# EAGLE board Varella_Std - v.2.0 (EAGLE 9.4.2)
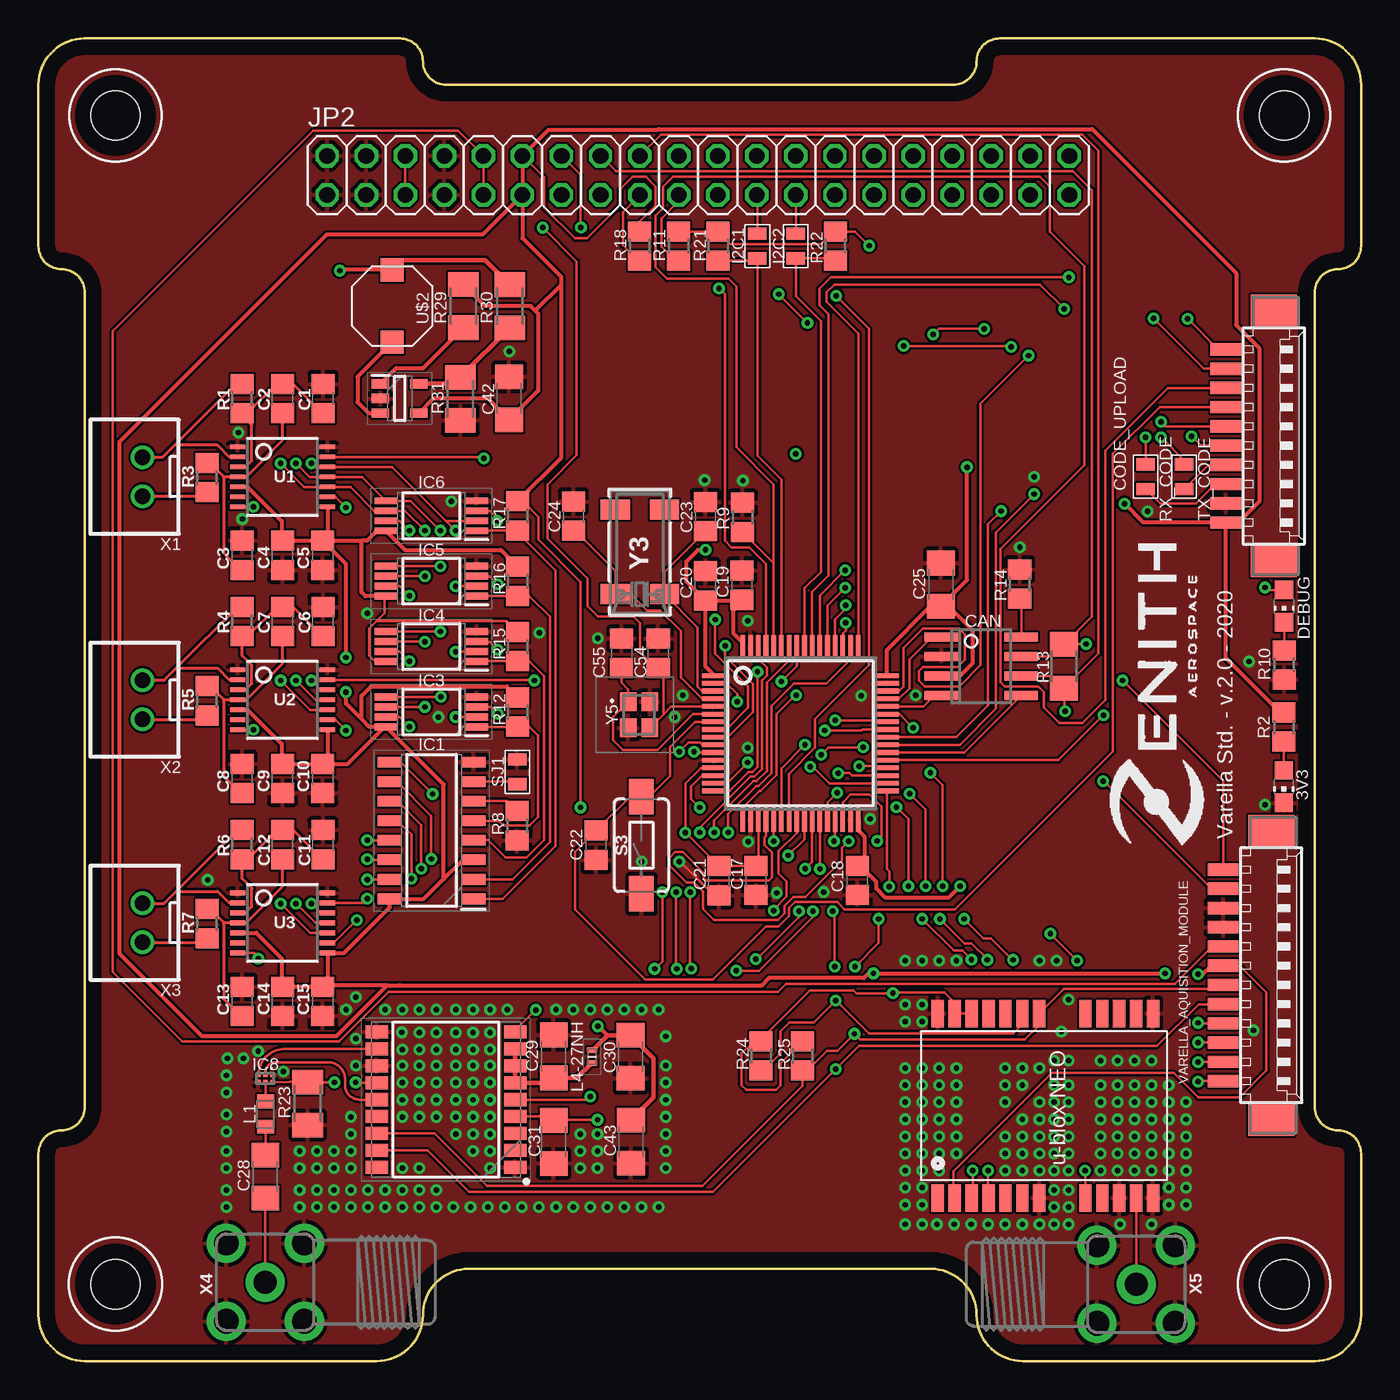
[diagram p2: board, top side]
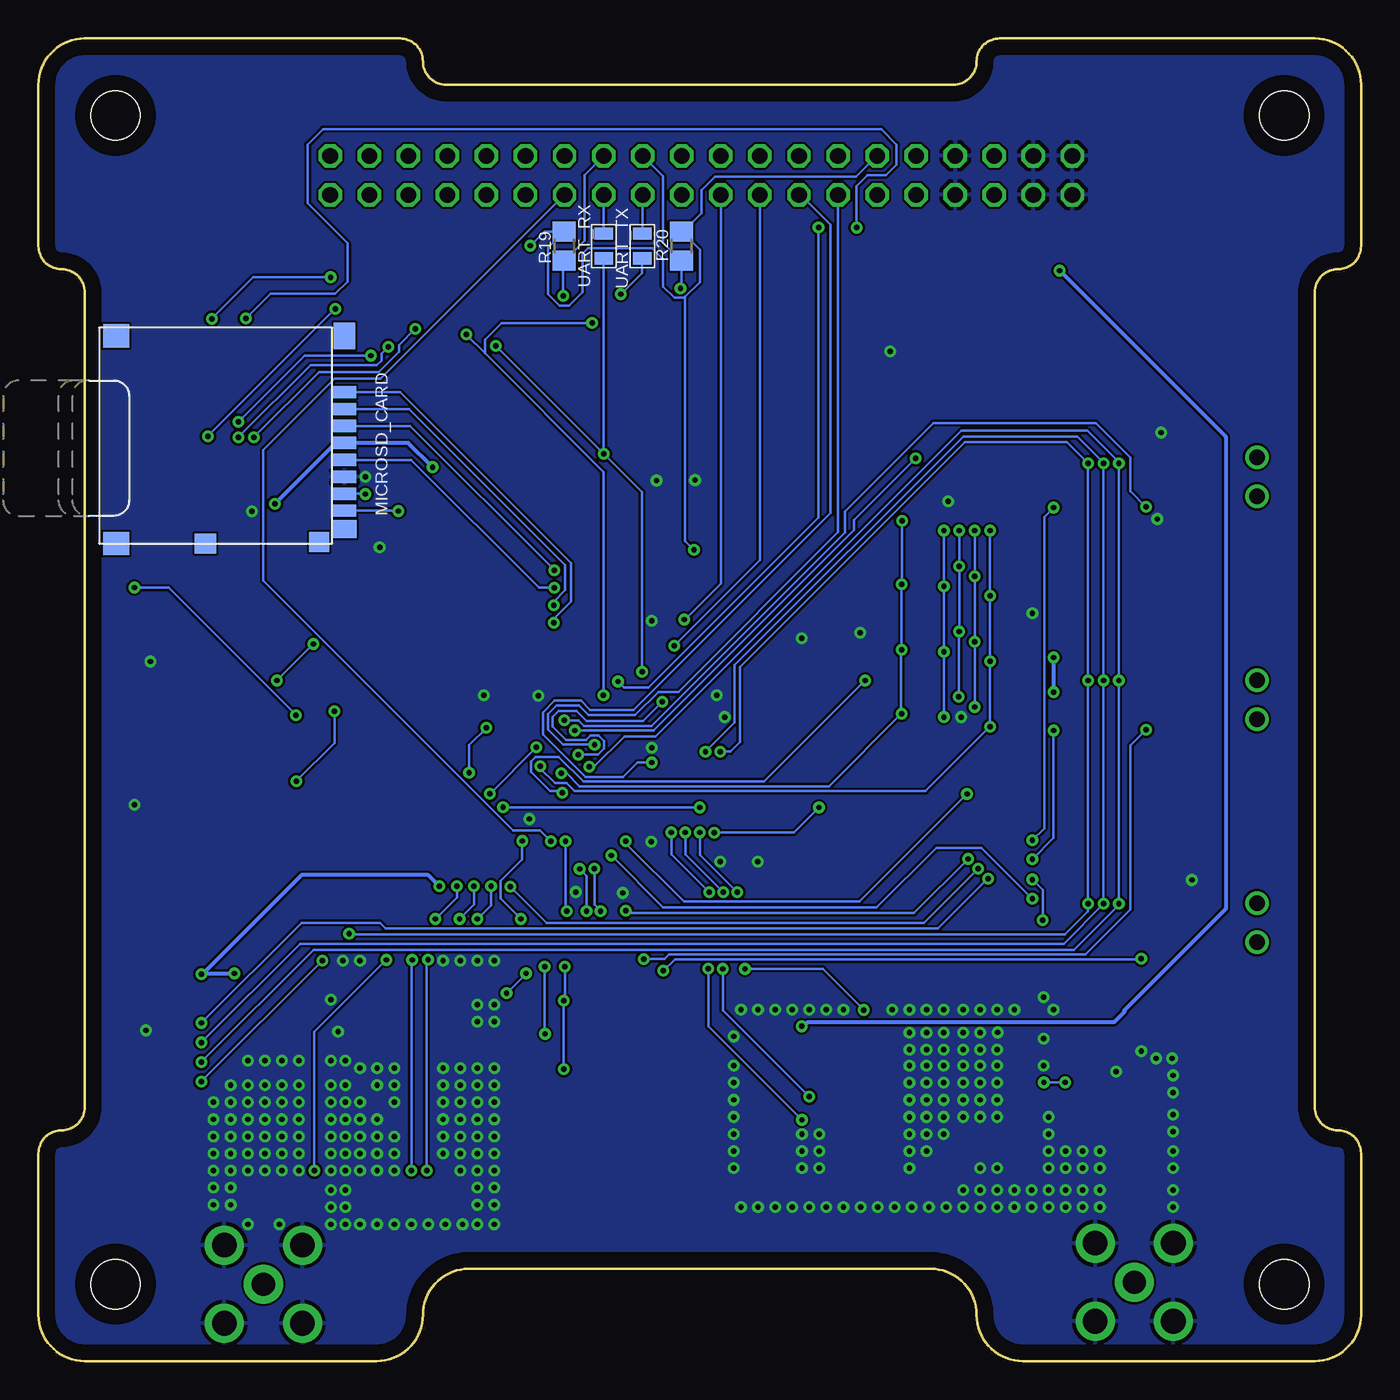
[diagram p3: board, bottom side, seen from below]

Size 86 x 86 mm. Coordinates in mm from the lower left corner, seen from the top.
Outline: 0,83 0,72.5 arc90 1.5,71 arc-90 3,69.5 3,16.5 arc-90 1.5,15 arc90 0,13.5 0,3 arc90 3,0 22,0 arc90 25,3 arc-90 28,6 58,6 arc-90 61,3 arc90 64,0 83,0 arc90 86,3 86,13.5 arc90 84.5,15 arc-90 83,16.5 83,69.5 arc-90 84.5,71 arc90 86,72.5 86,83 arc90 83,86 62.5,86 arc90 61,84.5 arc-90 59.5,83 26.5,83 arc-90 25,84.5 arc90 23.5,86 3,86 arc90 0,83
Copper layers (1*16): Top 0.035mm / dielectric 1.5mm / Bottom 0.035mm
Design rules "default": minimum track width 6mil, minimum drill 0.35mm, track to track 6mil, track to pad 6mil, pad to pad 6mil, via to via 6mil, smd to smd 6mil, copper to edge 40mil, drill to drill 6mil, minimum pad ring 10mil, minimum via ring 8mil, stop-mask expansion 4mil, vias tented up to drill 0mil, thermal gap 10mil
Holes 3.2 mm at 5,5 81,5 81,81 5,81

## Footprints (pad centres in the part's own frame; a part is rotated, then mirrored left to right if it is on the bottom)
CHIP-LED0805 = smd 1.2 x 1.2: A 0,-1.05; C 0,1.05
C0805 = smd 1.3 x 1.5: 1 -0.95,0; 2 0.95,0
C1206 = smd 1.6 x 1.8: 1 -1.4,0; 2 1.4,0
SOIC8 = smd 0.6 x 2.2: 1 -1.905,-2.6; 2 -0.635,-2.6; 3 0.635,-2.6; 4 1.905,-2.6; 5 1.905,2.6; 6 0.635,2.6; 7 -0.635,2.6; 8 -1.905,2.6
53261-10 = smd 0.8 x 2: 1 5.625,-2.5; 2 4.375,-2.5; 3 3.125,-2.5; 4 1.875,-2.5; 5 0.625,-2.5; 6 -0.625,-2.5; 7 -1.875,-2.5; 8 -3.125,-2.5; 9 -4.375,-2.5; 10 -5.625,-2.5 | smd 2.1 x 3: S1 8.125,0.625; S2 -8.125,0.625
LQFP64_10X10 = smd 0.3 x 1.6: 1 -3.75,-5.6; 2 -3.25,-5.6; 3 -2.75,-5.6; 4 -2.25,-5.6; 5 -1.75,-5.6; 6 -1.25,-5.6; 7 -0.75,-5.6; 8 -0.25,-5.6; 9 0.25,-5.6; 10 0.75,-5.6; 11 1.25,-5.6; 12 1.75,-5.6; 13 2.25,-5.6; 14 2.75,-5.6; 15 3.25,-5.6; 16 3.75,-5.6; 33 3.75,5.6; 34 3.25,5.6; 35 2.75,5.6; 36 2.25,5.6; 37 1.75,5.6; 38 1.25,5.6; 39 0.75,5.6; 40 0.25,5.6; 41 -0.25,5.6; 42 -0.75,5.6; 43 -1.25,5.6; 44 -1.75,5.6; 45 -2.25,5.6; 46 -2.75,5.6; 47 -3.25,5.6; 48 -3.75,5.6 | smd 1.6 x 0.3: 17 5.6,-3.75; 18 5.6,-3.25; 19 5.6,-2.75; 20 5.6,-2.25; 21 5.6,-1.75; 22 5.6,-1.25; 23 5.6,-0.75; 24 5.6,-0.25; 25 5.6,0.25; 26 5.6,0.75; 27 5.6,1.25; 28 5.6,1.75; 29 5.6,2.25; 30 5.6,2.75; 31 5.6,3.25; 32 5.6,3.75; 49 -5.6,3.75; 50 -5.6,3.25; 51 -5.6,2.75; 52 -5.6,2.25; 53 -5.6,1.75; 54 -5.6,1.25; 55 -5.6,0.75; 56 -5.6,0.25; 57 -5.6,-0.25; 58 -5.6,-0.75; 59 -5.6,-1.25; 60 -5.6,-1.75; 61 -5.6,-2.25; 62 -5.6,-2.75; 63 -5.6,-3.25; 64 -5.6,-3.75
SMD-JUMPER-2 = smd 0.8 x 1.2: 1 -0.8,0; 2 0.8,0
SOIC127P600X175-16N = smd 1.55 x 0.7: 1 -2.725,4.445; 2 -2.725,3.175; 3 -2.725,1.905; 4 -2.725,0.635; 5 -2.725,-0.635; 6 -2.725,-1.905; 7 -2.725,-3.175; 8 -2.725,-4.445; 9 2.725,-4.445; 10 2.725,-3.175; 11 2.725,-1.905; 12 2.725,-0.635; 13 2.725,0.635; 14 2.725,1.905; 15 2.725,3.175; 16 2.725,4.445
SOP65P640X120-8N = smd 1.475 x 0.45: 1 -2.938,0.975; 2 -2.938,0.325; 3 -2.938,-0.325; 4 -2.938,-0.975; 5 2.938,-0.975; 6 2.938,-0.325; 7 2.938,0.325; 8 2.938,0.975
SON110P970X1010X230-18N = smd 1.45 x 0.85: 1 -4.5,4.4; 2 -4.5,3.3; 3 -4.5,2.2; 4 -4.5,1.1; 5 -4.5,0; 6 -4.5,-1.1; 7 -4.5,-2.2; 8 -4.5,-3.3; 9 -4.5,-4.4; 10 4.5,-4.4; 11 4.5,-3.3; 12 4.5,-2.2; 13 4.5,-1.1; 14 4.5,0; 15 4.5,1.1; 16 4.5,2.2; 17 4.5,3.3; 18 4.5,4.4
BGA725L6E6327 = smd 0.3 x 0.3: 1 0.45,0.25; 2 0,0.25; 3 -0.45,0.25; 4 -0.45,-0.25; 5 0,-0.25; 6 0.45,-0.25
SOT95P280X110-5N = smd 1.15 x 0.6: 1 -1.25,0.95; 2 -1.25,0; 3 -1.25,-0.95; 4 1.25,-0.95; 5 1.25,0.95
2X20 = drill 1.016 octagon: 1 -24.13,-1.27; 2 -24.13,1.27; 3 -21.59,-1.27; 4 -21.59,1.27; 5 -19.05,-1.27; 6 -19.05,1.27; 7 -16.51,-1.27; 8 -16.51,1.27; 9 -13.97,-1.27; 10 -13.97,1.27; 11 -11.43,-1.27; 12 -11.43,1.27; 13 -8.89,-1.27; 14 -8.89,1.27; 15 -6.35,-1.27; 16 -6.35,1.27; 17 -3.81,-1.27; 18 -3.81,1.27; 19 -1.27,-1.27; 20 -1.27,1.27; 21 1.27,-1.27; 22 1.27,1.27; 23 3.81,-1.27; 24 3.81,1.27; 25 6.35,-1.27; 26 6.35,1.27; 27 8.89,-1.27; 28 8.89,1.27; 29 11.43,-1.27; 30 11.43,1.27; 31 13.97,-1.27; 32 13.97,1.27; 33 16.51,-1.27; 34 16.51,1.27; 35 19.05,-1.27; 36 19.05,1.27; 37 21.59,-1.27; 38 21.59,1.27; 39 24.13,-1.27; 40 24.13,1.27
INDC1608X100N = smd 0.89 x 1.11: 1 -0.814,0; 2 0.814,0
LQG15WH0N7B02D = smd 0.35 x 0.65: 1 -0.425,0; 2 0.425,0
MOLEX-502774-0891-MICROSD = smd 0.8 x 1.5: 1 -3.3,8.2; 2 -2.2,8.2; 3 -1.1,8.2; 4 0,8.2; 5 1.1,8.2; 6 2.2,8.2; 7 3.3,8.2; 8 4.4,8.2 | smd 1.29 x 1.3: 9 6.455,6.55 | smd 1.29 x 1.4: 10 6.54,-0.85 | smd 1.5 x 1.7: 11 6.54,-6.65; 12 -6.96,-6.65 | smd 1.7 x 1.4: 14 -6.96,8.2 | smd 1.2 x 1.6: 15 5.6,8.2
R0805 = smd 1.3 x 1.5: 1 -0.95,0; 2 0.95,0
R1206 = smd 1.6 x 1.803: 1 -1.422,0; 2 1.422,0
M1206 = smd 1.6 x 2: 1 -1.4,0; 2 1.4,0
TACTILE_SWITCH_SMD_6.0X3.5MM = smd 2.3 x 1.6: 1 -3.15,0; 2 3.15,0
TSSOP14 = smd 0.305 x 0.991: 1 -1.95,-2.918; 2 -1.3,-2.918; 3 -0.65,-2.918; 4 0,-2.918; 5 0.65,-2.918; 6 1.3,-2.918; 7 1.95,-2.918; 8 1.95,2.918; 9 1.3,2.918; 10 0.65,2.918; 11 0,2.918; 12 -0.65,2.918; 13 -1.3,2.918; 14 -1.95,2.918
LTF5022T = smd 1.5 x 1.5: P$1 -2.35,0; P$2 2.35,0
NEO-M8 = smd 1.8 x 0.8: 1 6.4,-7.4; 2 6.4,-6.3; 3 6.4,-5.2; 4 6.4,-4.1; 5 6.4,-3; 6 6.4,-1.9; 7 6.4,-0.8; 8 6.4,2.2; 9 6.4,3.3; 10 6.4,4.4; 11 6.4,5.5; 12 6.4,6.6; 13 -5.6,6.6; 14 -5.6,5.5; 15 -5.6,4.4; 16 -5.6,3.3; 17 -5.6,2.2; 18 -5.6,-0.8; 19 -5.6,-1.9; 20 -5.6,-3; 21 -5.6,-4.1; 22 -5.6,-5.2; 23 -5.6,-6.3; 24 -5.6,-7.4
53261-12 = smd 0.8 x 2: 1 6.875,-2.5; 2 5.625,-2.5; 3 4.375,-2.5; 4 3.125,-2.5; 5 1.875,-2.5; 6 0.625,-2.5; 7 -0.625,-2.5; 8 -1.875,-2.5; 9 -3.125,-2.5; 10 -4.375,-2.5; 11 -5.625,-2.5; 12 -6.875,-2.5 | smd 2.1 x 3: S1 9.375,0.625; S2 -9.375,0.625
JST-XH-02-PACKAGE-ROUND-PAD = drill 1.016: 1 -1.27,0; 2 1.27,0
SMA90_DIP = drill 1.5 pad 2.54: ANTENNA 0,0 | drill 1.6 pad 2.54: GND1 -2.54,2.54; GND2 2.54,2.54; GND3 -2.54,-2.54; GND4 2.54,-2.54
CRYSTAL_8X3.8 = smd 1.3 x 1.9: P$1 -2.75,-1.6; P$2 2.75,-1.6; P$3 2.75,1.6; P$4 -2.75,1.6
FA20H160000MF12ZAC3 = smd 1.2 x 1.1: 1 -0.85,-0.7; 2 0.85,-0.7; 3 0.85,0.7; 4 -0.85,0.7

## Placement (x,y rotation side)
3V3  [CHIP-LED0805]  80.97,37.35 180 top
C1  0.01uF  [C0805]  18.5,62.58 270 top
C2  0.1uF  [C0805]  15.87,62.58 270 top
C3  0.01uF  [C0805]  13.24,52.39 90 top
C4  0.1uF  [C0805]  15.87,52.39 270 top
C5  0.1uF  [C0805]  18.49,52.39 270 top
C6  0.01uF  [C0805]  18.5,48.08 270 top
C7  0.1uF  [C0805]  15.87,48.08 270 top
C8  0.01uF  [C0805]  13.24,37.89 90 top
C9  0.1uF  [C0805]  15.87,37.89 270 top
C10  0.1uF  [C0805]  18.49,37.89 270 top
C11  0.01uF  [C0805]  18.5,33.58 270 top
C12  0.1uF  [C0805]  15.87,33.58 270 top
C13  0.01uF  [C0805]  13.24,23.39 90 top
C14  0.1uF  [C0805]  15.87,23.39 270 top
C15  0.1uF  [C0805]  18.49,23.39 270 top
C17  100nF  [C0805]  46.66,31.25 270 top
C18  100nF  [C0805]  53.24,31.25 270 top
C19  100nF  [C0805]  45.74,50.45 90 top
C20  100nF  [C0805]  43.37,50.41 90 top
C21  1uF  [C0805]  44.24,31.23 270 top
C22  0,1uF  [C0805]  36.26,33.54 90 top
C23  10pF  [C0805]  43.37,54.91 270 top
C24  10pF  [C0805]  34.79,54.94 270 top
C25  1nF  [C1206]  58.67,50.49 90 top
C28  1nF  [C1206]  14.75,12 270 top
C29  56pF  [C1206]  33.5,19.81 90 top
C30  10nF  [C1206]  38.5,19.79 270 top
C31  56pF  [C1206]  33.5,14.25 90 top
C42  56pF  [C1206]  30.61,62.6 90 top
C43  22uF  [C1206]  38.52,14.27 270 top
C54  10pF  [C0805]  40.3,46.02 90 top
C55  10pF  [C0805]  37.92,46.02 90 top
CAN  SN65HVD233D  [SOIC8]  61.3,45.17 270 top
CODE_UPLOAD  53261-10  [53261-10]  79.7,60.15 270 top
COMM_MICRO  STM32L496RGT6  [LQFP64_10X10]  49.55,40.82 270 top
DEBUG  [CHIP-LED0805]  81,49.1 180 top
I2C1  [SMD-JUMPER-2]  46.75,72.5 270 top
I2C2  [SMD-JUMPER-2]  49.25,72.5 270 top
IC1  74HC4051D,653  [SOIC127P600X175-16N]  25.56,34.5 180 top
IC3  M95M04-DRDW6TP  [SOP65P640X120-8N]  25.55,42.21 180 top
IC4  M95M04-DRDW6TP  [SOP65P640X120-8N]  25.55,46.46 180 top
IC5  M95M04-DRDW6TP  [SOP65P640X120-8N]  25.55,50.71 180 top
IC6  M95M04-DRDW6TP  [SOP65P640X120-8N]  25.55,54.96 180 top
IC7  TESEO-LIV3F  [SON110P970X1010X230-18N]  26.5,17 180 top
IC8  BGA_725L6_E6327  [BGA725L6E6327]  14.75,18.38 0 top
IC13  ST1S12GR  [SOT95P280X110-5N]  23.49,62.59 0 top
JP2  [2X20]  42.9,77.1 0 top
L1  LQW18AS7N5J0ZD-7,5nH  [INDC1608X100N]  14.78,16.07 270 top
L4-27NH  LQG15HS27NJ02D  [LQG15WH0N7B02D]  36,19.79 270 top
MICROSD_CARD  MOLEX-502774-0891-MICROSD  [MOLEX-502774-0891-MICROSD]  74.3,59.7 270 bottom
R1  100  [R0805]  13.24,62.58 270 top
R2  220  [R0805]  80.98,41.22 90 top
R3  100  [R0805]  10.96,57.44 90 top
R4  100  [R0805]  13.24,48.08 270 top
R5  100  [R0805]  10.96,42.94 90 top
R6  100  [R0805]  13.24,33.58 270 top
R7  100  [R0805]  10.96,28.44 90 top
R8  1k  [R0805]  31.12,34.81 90 top
R9  1k  [R0805]  45.78,54.87 90 top
R10  220  [R0805]  81,45.26 90 top
R11  4,7k  [R0805]  41.62,72.5 90 top
R12  4,7k  [R0805]  31.16,42.2 90 top
R13  120  [R1206]  66.67,45.17 270 top
R14  100  [R0805]  63.8,50.52 270 top
R15  4,7k  [R0805]  31.16,46.45 90 top
R16  4,7k  [R0805]  31.16,50.7 90 top
R17  4,7k  [R0805]  31.16,54.95 90 top
R18  4,7k  [R0805]  39.09,72.5 90 top
R19  4,7k  [R0805]  51.81,72.5 90 bottom
R20  4,7k  [R0805]  44.19,72.5 90 bottom
R21  4,7k  [R0805]  44.19,72.5 270 top
R22  4,7k  [R0805]  51.81,72.5 270 top
R23  10k  [M1206]  17.5,16.75 90 top
R24  4,7k  [R0805]  46.99,19.84 90 top
R25  4,7k  [R0805]  49.69,19.84 90 top
R29  1M  [M1206]  27.63,68.6 90 top
R30  68k  [M1206]  30.65,68.59 90 top
R31  27k  [M1206]  27.43,62.57 90 top
RX_CODE  [SMD-JUMPER-2]  72,57.5 270 top
S3  MOMENTARY-SWITCH-SPST-SMD-6.0X3.5MM  [TACTILE_SWITCH_SMD_6.0X3.5MM]  39.2,33.53 90 top
SJ1  [SMD-JUMPER-2]  31.12,38.31 90 top
TX_CODE  [SMD-JUMPER-2]  74.5,57.5 270 top
U1  MAX31856  [TSSOP14]  15.87,57.49 270 top
U2  MAX31856  [TSSOP14]  15.87,42.99 270 top
U3  MAX31856  [TSSOP14]  15.87,28.49 270 top
U$2  LTF5022T100M1R4  [LTF5022T]  23,68.6 270 top
U$3  NEO-M8  [NEO-M8]  65.88,17 270 top
UART_RX  [SMD-JUMPER-2]  49.25,72.5 270 bottom
UART_TX  [SMD-JUMPER-2]  46.75,72.5 270 bottom
VARELLA_AQUISITION_MODULE  53261-12  [53261-12]  79.53,25.08 270 top
X1  JST-XH-02-PIN-ROUND-PAD  [JST-XH-02-PACKAGE-ROUND-PAD]  6.77,57.5 90 top
X2  JST-XH-02-PIN-ROUND-PAD  [JST-XH-02-PACKAGE-ROUND-PAD]  6.77,43 90 top
X3  JST-XH-02-PIN-ROUND-PAD  [JST-XH-02-PACKAGE-ROUND-PAD]  6.77,28.5 90 top
X4  [SMA90_DIP]  14.75,5.12 270 top
X5  [SMA90_DIP]  71.38,5 90 top
Y3  [CRYSTAL_8X3.8]  39.11,52.61 90 top
Y5  FA-20H_16.0000MF10Z-AJ0  [FA20H160000MF12ZAC3]  39.05,42.02 270 top

## Tracks (layer width: path | path; a pad name or v marks a point on that pad's centre or on a via)
!DRDY_1  (via drill 0.35)
  Top 0.152: U1.7 v13.98,55.54 | v51.81,41.66 54.25,41.66 54.34,41.57 COMM_MICRO.42
  Bottom 0.152: v13.98,55.54 15,56.56 15,58.75 17.25,61 27.81,61 33.56,55.25 33.56,53.88 46.13,41.3 50.52,41.3 50.88,41.66 v51.81,41.66
!DRDY_2  (via drill 0.35)
  Top 0.152: U2.7 v13.98,41.04 | v49.45,29.25 49.45,28.88 46.72,26.14 v46.64,26.14 | v49.86,32.02 50.3,32.47 COMM_MICRO.26
  Bottom 0.152: v13.98,41.04 15,40.02 15,29.38 17.94,26.44 45,26.44 45.29,26.14 v46.64,26.14 | v49.86,32.02 49.86,29.7 49.45,29.3 v49.45,29.25
!DRDY_3  (via drill 0.35)
  Top 0.152: U3.7 14.02,26.54 v14.29,26.16 | v50.36,29.25 50.36,28.89 46.84,25.38 v45.38,25.38 | COMM_MICRO.27 v50.8,32.01 v50.81,32
  Bottom 0.152: v14.29,26.16 14.33,26.12 44.62,26.12 v45.38,25.38 | v50.81,32 50.36,31.55 v50.36,29.25
!FAULT_1  (via drill 0.35)
  Top 0.152: U1.13 28.87,58.79 v28.97,58.69 | v51.12,41 53.5,41 53.57,41.07 COMM_MICRO.41
  Bottom 0.152: v28.97,58.69 32.97,54.69 32.97,54.03 46,41 v51.12,41
!FAULT_2  (via drill 0.35)
  Top 0.152: U2.13 32.21,44.29 v32.25,44.25 | v51.93,36.95 51.3,36.32 COMM_MICRO.28
  Bottom 0.152: v32.25,44.25 38.81,37.69 50.56,37.69 52.17,39.29 53.69,39.29 53.98,39 53.98,38.31 52.73,37.05 52.04,37.05 v51.93,36.95
!FAULT_3  (via drill 0.35)
  Top 0.152: 19.16,29.79 U3.13 21.1,29.79 v21.38,30.06 | COMM_MICRO.25 49.8,33.93 v48.75,32.88
  Bottom 0.152: v21.38,30.06 24.69,33.38 27.62,33.38 31.5,29.5 45.38,29.5 v48.75,32.88
!HOLD  (via drill 0.35)
  Top 0.152: IC6.7 23.49,54.63 v24.12,54 | IC5.7 23.49,50.38 v24.12,49.75 | IC4.7 23.49,46.13 v24.12,45.5 | IC3.7 23.49,41.88 v24.12,41.25 | v53.38,38.69 54.19,38.69 54.3,38.57 COMM_MICRO.36
  Bottom 0.152: v24.12,54 v24.12,49.75 v24.12,45.5 v24.12,41.25 28.31,37.06 51.13,37.06 51.66,37.59 52.42,37.59 53.38,38.55 v53.38,38.69
!W  (via drill 0.35)
  Top 0.152: v29.84,54.62 29.84,54.81 29.37,55.28 IC6.3 | IC5.3 28.52,51 29.38,51 v29.88,50.5 | IC4.3 28.52,46.75 29.38,46.75 v29.88,46.25 | IC3.3 29.43,42.53 v29.88,42.09 | v52,38.23 52.72,38.23 52.88,38.07 COMM_MICRO.35
  Bottom 0.152: v29.84,54.62 29.84,50.53 v29.88,50.5 v29.88,46.25 29.91,46.22 29.91,42.12 v29.88,42.09 34.59,37.38 50.81,37.38 51.67,38.23 v52,38.23
+3V3  (via drill 0.35)
  Top 0.152: 15.82,38.84 C9.1 | 15.82,24.34 C14.1 | 15.82,53.34 C4.1 | 58.67,49.8 58.67,49.62 | 58.67,49.62 C25.1 | 59.91,44.54 59.94,44.56 | 59.38,48.88 59.17,49.09 58.88,49.09 | COMM_MICRO.19 46.8,32.35 C17.1 46.64,32.19 C21.1 v42.06,34.36 42.06,37.56 43.07,38.57 COMM_MICRO.13 | 53.3,32.26 C18.1 | C18.1 | 58.25,49.55 58.6,49.55 58.67,49.62 | 45.8,49.44 C19.1 45.7,49.45 45.56,49.45 | 43.37,49.38 C20.1 | IC3.8 22.5,41.23 | IC4.8 21.89,45.48 21.5,45.88 21.5,47.62 22,48.12 | 22,48.12 30.44,48.12 R15.2 | IC5.8 22.5,49.73 | 22.5,49.73 21.89,49.73 | 30.44,52.38 31.03,51.78 R16.2 | IC6.8 22,53.98 21.89,53.98 | 22.5,49.73 22.5,48.62 22,48.12 | IC1.16 23.8,30.05 | IC1.3 28.25,32.59 | R11.2 R21.1 45.01,72.62 50.89,72.62 51.71,73.45 R22.1 53.09,73.45 v54.01,72.52 | JP2.11 31.45,75.81 | 5.26,26.5 5.26,26.49 | R18.2 39.09,74.09 40.12,75.12 40.12,76.38 39.5,77 38.62,77 37.86,76.24 37.86,75.19 35.67,73 34.88,73 32.88,75 32.88,76.97 JP2.12 | 23.5,24.44 22.31,24.44 22.31,24.43 | U$3.23 U$3.22 60.67,23.3 | 22.68,24.43 22.31,24.43 | 18.75,24.43 22.31,24.43 | 31.45,56.11 31.27,55.93 31.19,55.93 R17.2 31.5,55.91 32.51,54.89 32.51,53.41 35.25,50.66 v35.25,36 | 53.37,32.07 C18.1 | 59.23,30.18 59.17,30.12 | 19.79,52.04 19.73,52.1 | U$3.23 59.58,23.43 | 77.38,54.52 CODE_UPLOAD.1 | U$3.2 59.5,10.68 59.5,12.35 65.88,18.73 73.82,18.73 75.41,17.14 78.11,17.14 79.85,18.89 79.85,23.97 78.11,25.71 VARELLA_AQUISITION_MODULE.7 | U$3.23 59.58,23.29 58.9,23.97 55.62,23.97 v55.56,23.91 53.19,23.91 53,24.1 50.16,24.1 46.99,20.93 R24.2 46.51,20.79 45.72,20 45.72,17.94 46.04,17.62 47.94,17.62 48.26,17.94 48.26,19.36 R25.2
  Top 0.203: 18.7,39.05 C10.1 | 18.79,24.64 18.58,24.43
  Top 0.254: JP2.11 28.89,73.25 18.75,73.25 5.26,59.76 5.26,26.5 | 22.68,24.43 19.4,21.15 10.6,21.15 5.26,26.49 | 22.68,24.43 18.75,24.43 18.58,24.43 C15.1 C14.1 | 18.79,24.64 U3.8 19.88,26.54 22.84,29.5 IC1.16 25.05,30.05 26.34,31.34 | U3.5 14.16,27.84 15.82,26.18 15.82,24.34 | 28.25,32.59 27.59,32.59 26.34,31.34 | 26.34,31.34 26.34,37.5 IC3.8 21.52,41.23 21,41.75 | 22.5,41.23 20.11,38.84 C10.1 C9.1 | 18.7,39.05 18.79,39.14 U2.8 | U2.5 13.61,42.34 15.82,40.13 15.82,38.84 | v20,43.5 20,42.75 21,41.75 | 21,41.75 21,43.25 21.62,43.88 30.44,43.88 R12.2 | v20,45.75 20,51.83 19.79,52.04 | 19.73,52.1 C5.1 | C4.1 C5.1 | C5.1 21,53.34 | 21,53.34 21.36,53.34 22,53.98 | IC5.8 21.27,49.73 21,50 21,53.34 | IC6.8 23.84,52.75 30.07,52.75 31.03,51.78 | U1.8 18.79,53.64 C5.1 | U1.5 13.61,56.84 15.82,54.63 15.82,53.34 | JP2.11 JP2.12 33.16,80.06 40.27,80.06 40.32,80.11 68.52,80.11 77.88,70.75 77.88,67.38 79.38,65.88 79.38,55.88 78.03,54.52 77.38,54.52 | v70.62,55.75 71.85,54.52 CODE_UPLOAD.1 77.2,45.72 80.74,42.17 R2.2 | 58.88,49.09 C25.1 | C25.1 60.38,50.79 v60.38,58.12 | CAN.3 59.91,44.54 | 59.94,44.56 60.74,45.36 60.74,47.52 59.38,48.88 | COMM_MICRO.48 55.16,46.23 58.01,49.09 C25.1 | COMM_MICRO.64 45.8,46.7 45.19,47.31 45.19,48.82 45.8,49.44 | 45.56,49.45 C20.1 42.12,50.7 42.12,52 42.88,52.75 v43.38,52.75 | 43.37,49.38 43.34,49.35 43.34,45.18 COMM_MICRO.1 | 22.68,24.43 22.69,24.44 23.5,24.44 47.04,24.44 47.5,24.9 53.66,24.9 53.98,25.21 v54.29,25.21 v73.26,25.21 | v59.92,30.88 59.23,30.18 | 59.17,30.12 55.08,30.12 54.48,30.73 54.48,31.16 53.57,32.07 53.37,32.07 | COMM_MICRO.32 53.34,35.19 53.34,34.48 53.7,34.11 53.7,32.66 53.3,32.26
  Top 0.254: R17.2 34,58.74 34,70 | 34,70 34,70.47 31.47,73 JP2.11 | 34,70 32.3,68.3 | R29.2 29.03,68.6 32,68.6 32.3,68.3 | 32.3,68.3 32.5,68.1 32.5,63.09 C42.1 29.2,62.6 25.7,62.6 IC13.4 | v75.41,25.16 75.72,25.16 76.27,25.71 VARELLA_AQUISITION_MODULE.7
  Bottom 0.152: 66.2,59.6 MICROSD_CARD.4 66.67,59.7 | 43.95,69.2 44,69.14 44.64,69.14 45.38,69.88 45.38,71.65 46.1,72.38 50.25,72.38 50.62,72 50.62,69.5 51.5,68.62 52.12,68.62 52.88,69.38 52.88,72.39 R22.1 53.09,73.45 v54.01,72.52 | 43.95,69.2 43,70.14 43,72.26 44.12,73.38 | 44.12,73.38 R21.1 | JP2.12 32.84,77 42,77 42.88,76.12 42.88,74.62 44.12,73.38 | v42.06,34.36 36.89,34.36 v35.25,36 | v43.38,52.75 43.95,53.32 43.95,69.2 | v55.56,23.91 54.29,25.18 v54.29,25.21
  Bottom 0.254: v20,45.75 v20,43.5 | v70.62,55.75 66.67,59.7 | v60.38,58.12 61.95,59.7 MICROSD_CARD.4 | v59.92,30.88 60.65,31.6 68.9,31.6 75.34,25.16 v75.41,25.16 75.36,25.21 v73.26,25.21
+5V
  Top 0.152: JP2.9 JP2.10 27.3,80 17.88,80 4.83,66.96 4.83,25.29 9.35,20.77 19.56,20.77 22.78,24 48.1,24 48.62,24.52 73.89,24.52 76.36,26.99 77,26.99 VARELLA_AQUISITION_MODULE.8
BAT+
  Top 0.152: JP2.5 JP2.6
BOOT
  Top 0.152: R9.1 47.8,51.9 | 47.8,51.9 COMM_MICRO.60 | 47.8,51.9 47.8,57 45.38,59.43 45.38,69.88 44.88,70.38 40.88,70.38 40.12,71.13 40.12,74.47 40.62,74.97 40.62,76.38 41.25,77 65.12,77 65.75,76.38 65.75,73.45 68,71.2 68,58.25 62.55,52.8 62.55,44.16 62.84,43.88 65,43.88 65.08,43.8 65.09,43.8 65.38,43.52 65.38,42.5 66.38,41.5 67.88,41.5 69.38,43 69.38,59.2 73.45,63.27 CODE_UPLOAD.8 77.9,63.27
CAN1_LBK
  Top 0.152: COMM_MICRO.38 60.2,39.57 CAN.5
CAN1_RX
  Top 0.152: 55.95,42.57 COMM_MICRO.44 | 55.95,42.57 COMM_MICRO.44 | CAN.4 58.25,43.27 57.55,42.57 COMM_MICRO.44
CAN1_TX
  Top 0.152: CAN.1 58.09,47.08 56.63,45.62 56.63,43.74 55.95,43.07 COMM_MICRO.45
CAN_H  (via drill 0.35)
  Top 0.152: R13.1 65.89,45.81 CAN.7 | JP2.16 37.55,77.38 67.25,77.38 68.5,76.12 68.5,48.42 R13.1 | v68.12,46.62 66.7,46.62 R13.1 | VARELLA_AQUISITION_MODULE.12 77.03,37.72 v70.5,44.25
  Bottom 0.152: v70.5,44.25 v68.12,46.62
CAN_L  (via drill 0.35)
  Top 0.152: CAN.6 65.89,44.54 R13.2 66.71,43.79 | JP2.18 40.47,79.75 67.88,79.75 68.93,78.69 68.93,46.01 66.71,43.79 | v66.75,42.25 66.71,42.29 66.71,43.79 | VARELLA_AQUISITION_MODULE.11 76.29,30.71 69.29,37.71 v69.23,37.71
  Bottom 0.152: v69.23,37.71 66.75,40.19 v66.75,42.25
EXT_INTERRUPT_NEOM8  (via drill 0.35)
  Top 0.152: 44.75,44.06 43.96,44.06 COMM_MICRO.2 44.74,44.07 45.44,43.38 v45.44,42.88 | v50.89,39.42 51.38,39.9 v53.63,39.9 | v56.66,36.89 57.68,35.87 v57.68,30.88 | v61.7,26.08 61.7,26.14 60.68,27.16 60.2,27.16 v58.62,28.75 | v61.75,12.38 61.75,10.62 U$3.4
  Bottom 0.152: v50.89,39.42 50.88,39.44 49.62,39.44 49.23,39.83 49.23,40.33 49.59,40.69 50.09,40.69 50.39,40.39 51.7,40.39 52.56,41.25 52.56,41.88 52.17,42.27 51.01,42.27 50.35,41.61 46.7,41.61 v45.44,42.88 | v53.63,39.9 56.65,36.89 v56.66,36.89 | v57.68,30.88 57.68,29.69 v58.62,28.75 | 61.72,12.41 v61.75,12.38 61.75,26.08 v61.7,26.08
EXT_INTERRUPT_TESEO  (via drill 0.35)
  Top 0.152: v41.5,25.5 41.47,25.53 v41.47,30.48 | COMM_MICRO.58 48.8,45.55 47.36,44.11 47.36,38.37 46.7,37.7 46.49,37.7 43.94,35.15 v43.94,34.38 | IC7.5 35.69,17 v35.88,17.19
  Bottom 0.152: v43.94,34.38 43.94,32.95 v41.47,30.48 | v41.5,25.5 41.5,22.81 v35.88,17.19
GND  (via drill 0.35)
  Top 0.152: C21.2 43.93,30.29 41.75,32.47 v41.66,32.47
  other vias: 46.12,39.88 21.38,48.62 48,30.44 51.06,30.5 15.94,18.81 11,31.28 26.84,55.91 46.16,33.78 32.56,47.34 26,41.88 63.81,52.91 54.09,35.25 53.49,43.26 57.03,43.28 43.31,57.28 45.81,57.25 79,21.5 78.71,45.49 79.75,36.17 46.12,48.12 64.75,57.5 72.12,55.25 13.25,54.75 13,60.38 39.22,32.47 41.38,41.88 36.38,47 30.62,65.66 23.62,21.38 12.29,19.68 41.9,43.3 20.64,20.95 20.64,19.21 24.77,21.35 25.88,21.35 23.65,20.24 24.77,20.24 25.88,20.24 27.15,21.35 28.26,21.35 29.37,21.35 27.15,20.24 28.26,20.24 29.37,20.24 23.65,19.21 24.77,19.21 25.88,19.21 27.15,19.21 28.26,19.21 29.37,19.21 23.65,18.1 24.77,18.1 25.88,18.1 27.15,18.1 28.26,18.1 29.37,18.1 23.65,16.99 23.65,15.88 24.77,16.99 24.77,15.88 25.88,15.88 25.88,16.99 27.15,16.99 28.26,16.99 29.37,16.99 27.15,15.88 28.26,15.88 29.37,15.88 27.15,14.76 28.26,14.76 29.37,14.76 28.26,13.65 29.37,13.65 29.37,12.54 23.65,12.54 24.77,12.54 40.32,10 39.21,10 38.1,10 36.99,10 35.88,10 34.77,10 33.66,10 32.54,10 31.43,10 30.32,10 29.21,10 28.1,10 26.99,10 25.88,10 25.88,11.11 24.77,10 24.77,11.11 23.65,10 23.65,11.11 22.54,10 22.54,11.11 21.43,10 21.43,11.11 20.32,10 20.32,11.11 19.21,10 19.21,11.11 18.1,10 18.1,11.11 16.99,10 16.99,11.11 16.99,12.54 16.99,13.65 18.1,12.54 18.1,13.65 19.21,12.54 19.21,13.65 20.32,12.54 20.32,13.65 20.32,14.76 20.32,15.88 13.34,19.68 14.29,20.16 12.22,17.46 12.22,18.57 12.22,10 12.22,11.11 12.22,12.54 12.22,13.65 12.22,14.92 12.22,16.03 35.24,14.76 35.24,13.65 35.24,12.54 36.35,14.76 36.35,13.65 36.35,12.54 40.8,14.76 40.8,13.65 40.8,12.54 40.8,18.1 40.8,16.99 40.8,15.88 22.54,22.86 27.15,22.86 28.26,22.86 29.37,22.86 30.48,22.86 40.32,22.86 39.21,22.86 38.1,22.86 23.65,22.86 24.77,22.86 25.88,22.86 33.66,22.86 34.77,22.86 35.88,22.86 36.99,22.86 40.8,19.21 40.8,21.11 20,22.86 20.64,23.65 72.39,14.61 56.36,23.18 57.47,23.18 56.36,22.07 57.47,22.07 56.36,19.05 57.47,19.05 58.58,19.05 59.69,19.05 56.36,17.94 57.47,17.94 56.36,16.83 57.47,16.83 58.58,17.94 59.69,17.94 58.58,16.83 59.69,16.83 56.36,15.72 57.47,15.72 56.36,14.61 57.47,14.61 58.58,15.72 59.69,15.72 58.58,14.61 59.69,14.61 56.36,13.49 57.47,13.49 56.36,12.38 57.47,12.38 56.36,11.27 57.47,11.27 56.36,10.16 57.47,10.16 65.09,8.89 73.5,15.72 74.61,15.72 73.5,14.61 74.61,14.61 73.5,17.94 73.5,16.83 74.61,16.83 73.5,13.49 74.61,13.49 73.5,12.38 74.61,12.38 73.5,11.27 74.61,11.27 73.5,10.16 74.61,10.16 58.58,13.49 59.69,13.49 58.58,12.38 56.36,8.89 57.47,8.89 58.42,8.89 59.53,8.89 60.64,8.89 61.75,8.89 62.87,8.89 63.98,8.89 66.04,8.89 66.99,8.89 66.99,10 66.04,10 66.04,11.11 66.99,11.11 66.99,12.38 66.04,12.38 65.09,12.38 63.98,12.38 62.87,12.38 62.87,13.49 63.98,13.49 65.09,13.49 66.04,13.49 66.99,13.49 66.99,14.61 66.04,14.61 65.09,14.61 63.98,14.61 65.09,15.72 66.04,15.72 66.99,15.72 66.99,16.83 66.04,16.83 66.99,17.94 62.87,16.83 62.87,17.94 63.98,17.94 62.87,19.05 63.98,19.05 65.09,19.05 66.52,21.43 66.99,23.5 70.33,8.89 72.39,8.89 69.06,12.38 70.17,12.38 71.28,12.38 72.39,12.38 72.39,13.49 71.28,13.49 70.17,13.49 69.06,13.49 69.06,14.61 70.17,14.61 71.28,14.61 69.06,15.72 69.06,16.83 69.06,17.94 70.17,17.94 71.28,17.94 72.39,17.94 70.17,16.83 70.17,15.72 71.28,16.83 71.28,15.72 72.39,16.83 72.39,15.72 56.36,26.04 57.47,26.04 58.58,26.04 59.69,26.04 62.87,14.61 63.98,15.72 65.09,16.83 66.04,17.94 66.04,19.53 66.99,19.53 69.06,19.53 70.17,19.53 71.28,19.53 72.39,19.53 65.09,26.04 66.2,26.04
  pour Top: 64,0 83,0 arc90 86,3 86,13.5 arc90 84.5,15 arc-90 83,16.5 83,69.5 arc-90 84.5,71 arc90 86,72.5 86,83 arc90 83,86 62.5,86 arc90 61,84.5 arc-90 59.5,83 26.5,83 arc-90 25,84.5 arc90 23.5,86 3,86 arc90 0,83 0,72.5 arc90 1.5,71 arc-90 3,69.5 3,16.5 arc-90 1.5,15 arc90 0,13.5 0,3 arc90 3,0 22,0 arc90 25,3 arc-90 28,6 58,6 arc-90 61,3 arc90
  pour Bottom: 64,0 83,0 arc90 86,3 86,13.5 arc90 84.5,15 arc-90 83,16.5 83,69.5 arc-90 84.5,71 arc90 86,72.5 86,83 arc90 83,86 62.5,86 arc90 61,84.5 arc-90 59.5,83 26.5,83 arc-90 25,84.5 arc90 23.5,86 3,86 arc90 0,83 0,72.5 arc90 1.5,71 arc-90 3,69.5 3,16.5 arc-90 1.5,15 arc90 0,13.5 0,3 arc90 3,0 22,0 arc90 25,3 arc-90 28,6 58,6 arc-90 61,3 arc90
L3
  Top 0.152: 3V3.A R2.1
MISO_BUS  (via drill 0.35)
  Top 0.152: COMM_MICRO.22 48.3,38.55 v49.84,40.08
  Bottom 0.152: v49.84,40.08 51.89,40.08 52.88,41.06 52.88,42.06 52.3,42.63 50.86,42.63 50.23,42 47.2,42 45.69,43.52 44.39,43.52 34.01,53.9 JP2.13
MISO_SENSOR  (via drill 0.35)
  Top 0.152: U2.12 18.36,43.64 v17.75,44.25 | U3.12 18.36,29.14 v17.75,29.75 | U1.12 | U1.12 17.98,58.14 v17.75,58.38 | IC5.2 27.14,50.38 v27.12,50.38 | IC4.2 27.14,46.13 v27.12,46.12 | IC3.2 27.14,41.88 v27.12,41.88 | U1.12 22.98,58.14 26.49,54.63 | 26.49,54.63 v27.12,54 | IC6.2 26.49,54.63 | COMM_MICRO.10 43.16,40.07 43,40.23 42.26,40.23 v41.66,39.62 | VARELLA_AQUISITION_MODULE.1 75.44,18.21 v75.41,18.18 | v67.55,26.04 v65.8,27.78
  Bottom 0.152: v27.12,54 v27.12,50.38 v27.12,46.12 v27.12,41.88 | v41.66,39.62 41,39.62 40.38,40.25 40.38,45.12 25.75,59.75 19.12,59.75 v17.75,58.38 v17.75,44.25 v17.75,29.75 17.75,29.25 19.25,27.75 65.77,27.75 v65.8,27.78 | v75.41,18.18 v67.55,26.04
MOSI_BUS  (via drill 0.35)
  Top 0.152: COMM_MICRO.57 49.3,45.18 v48.31,44.19 | v35.28,73.71 35.25,73.74 35.25,77.13 JP2.14
  Bottom 0.152: v35.28,73.71 35.28,54.85 46.33,43.8 47.92,43.8 v48.31,44.19
MOSI_SENSOR  (via drill 0.35)
  Top 0.152: U3.11 18.01,28.49 v16.75,29.75 | U2.11 18.01,42.99 v16.75,44.25 | v16.75,58.38 17.64,57.49 U1.11 21.05,57.49 IC6.5 24.19,55.94 v26.12,54 | IC5.5 v26.12,51.69 | IC4.5 v26.12,47.44 | IC3.5 v26.15,43.19 v26.16,43.19 | v42.62,39.62 42.68,39.57 COMM_MICRO.11 | VARELLA_AQUISITION_MODULE.3 75.42,20.71 v75.41,20.72
  Bottom 0.152: v26.12,54 v26.12,51.69 v26.12,47.44 26.16,47.41 v26.16,43.19 | v42.62,39.62 40.73,41.52 40.73,45.25 25.86,60.12 18.46,60.12 16.75,58.41 v16.75,58.38 v16.75,44.25 v16.75,29.75 16.75,29.71 19.34,27.12 69,27.12 v75.41,20.72
N$1
  Top 0.152: IC1.7 30.96,37.67 SJ1.1
N$5
  Top 0.152: X5.ANTENNA U$3.11
N$6
  Top 0.305: L4-27NH.2 35.95,19.36 35,18.41 C29.1 33.19,18.1 IC7.6 IC7.7 IC7.8
N$7
  Top 0.152: IC8.2 14.75,18.75 arc-90 15.44,19.44 18.81,19.44 arc-90 19.94,18.31 19.94,17.94 arc90 20.88,17 IC7.14
N$8
  Top 0.152: R8.2 30.48,36.41 IC1.6
N$9
  Top 0.152: C28.2 X4.ANTENNA
N$11  (via drill 0.35)
  Top 0.152: COMM_MICRO.37 66.32,39.07 v69.25,42 | DEBUG.A 79.89,50.15 v79.75,50.29
  Bottom 0.152: v79.75,50.29 77.54,50.29 v69.25,42
N$12
  Top 0.152: R10.2 DEBUG.C
N$13
  Top 0.152: 43.18,43.57 COMM_MICRO.3 43.16,43.57 42.86,43.86 42.86,47.71 Y3.P$1 40.71,51.3 C23.2
N$14
  Top 0.152: 43.18,43.07 COMM_MICRO.4 43.16,43.07 41.77,44.46 41.77,47.46 40.42,48.8 39.57,48.8 38.51,49.86 Y3.P$4 37.51,51.36 34.88,53.99 C24.2
N$15
  Top 0.152: IC8.3 arc-90 16.07,20.3 IC7.11
N$16  (via drill 0.35)
  Top 0.152: IC8.6 17.48,18.18 R23.2 17.55,18.1 17.57,18.12 v19.25,18.12 | v20.62,18.12 20.65,18.1 IC7.13
  Bottom 0.152: v20.62,18.12 v19.25,18.12
N$17
  Top 0.152: CAN.8 63.9,49.47 R14.2
N$18
  Top 0.152: L1.2 14.78,13.43 C28.1
N$19
  Top 0.152: L1.1 14.78,18.15 IC8.5
N$37
  Top 0.254: IC13.1 23.27,64.58 25,64.58 R29.1
N$38
  Top 0.254: IC13.3 21.45,61.65 20.75,62.35 20.75,64 U$2.P$2
N$39
  Top 0.305: R30.1 27.52,64.06 | IC13.5 27.01,63.55
  Top 0.508: 27.01,63.55 27.28,63.82 | 27.28,63.82 R31.2 27.52,64.06 | 27.28,63.95 27.28,63.82
NRST
  Top 0.152: COMM_MICRO.7 42.7,41.57 41.05,39.92 41.05,38.05 39.69,36.69 S3.2 38.45,36.69 C22.2 34.88,33.11 34.88,29.38 39.44,24.81 43.88,24.81 47.31,28.25 48.12,28.25 48.81,28.94 48.81,29.47 49.2,29.86 51.94,29.86 52.42,29.38 59.6,29.38 69.88,39.65 69.88,59 72.9,62.02 CODE_UPLOAD.7
NSS_BUS  (via drill 0.35)
  Top 0.152: COMM_MICRO.20 47.3,34.15 47.21,34.05 47.21,33.54 47.56,33.19 47.69,33.06 47.69,31.44 47.5,31.25 43.44,31.25 43.25,31.44 43.25,31.75 41.91,33.09 41.41,33.09 41.03,32.72 41.03,32.22 42.12,31.12 42.62,31.12 43.23,30.52 43.23,29.4 43.94,28.69 48.09,28.69 48.51,29.1 48.51,29.6 49.1,30.19 49.88,30.19 52.25,32.56 52.25,33.38 v52.69,33.81
  Bottom 0.152: v52.69,33.81 53.38,34.5 55.12,34.5 71.38,50.75 71.38,59.25 66.75,63.88 63.74,63.88 JP2.27
OSC_IN  (via drill 0.35)
  Top 0.152: COMM_MICRO.5 43.84,42.45 | 43.16,42.57 COMM_MICRO.5 | 40.63,42.05 40.63,44.72 40.3,45.05 C54.1 40.12,45.08 39.1,46.1 39.1,48 38.7,48.4 36.39,48.4 35.69,49.1 35.69,50.89 33.1,53.48 33.1,57 35,58.9 35,71.5 v32.8,73.7 | Y5.3 40.63,42.05 | 40.63,42.05 41.15,42.57 COMM_MICRO.5 | v72.5,67.8 75.78,64.53 CODE_UPLOAD.9
  Bottom 0.152: v32.8,73.7 32.8,76.4 32.1,77.1 30.9,77.1 30.2,77.8 30.2,79.1 31.2,80.1 67.5,80.1 68.5,79.1 68.5,75.3 65.9,72.7 65.9,70.2 66.7,69.4 70.9,69.4 v72.5,67.8
OSC_OUT
  Top 0.152: C55.1 37.92,44.11 38.35,43.67 Y5.1 37.35,41.88 37.35,40.4 38,39.75 40.25,39.75 42.57,42.07 COMM_MICRO.6
PPS_NEOM8  (via drill 0.35)
  Top 0.152: COMM_MICRO.14 43.13,38.07 42.44,37.38 42.44,36.56 v43,36 | v55.79,36.02 56.57,35.24 v56.57,30.88 | v60.67,26.1 60.08,26.69 59.52,26.69 v57.46,28.75 | v60.75,12.38 60.75,10.68 U$3.3
  Bottom 0.152: v43,36 55.77,36 v55.79,36.02 | v56.57,30.88 56.57,29.64 v57.46,28.75 | v60.74,12.38 v60.75,12.38 60.75,26.1 v60.67,26.1
PPS_TESEO  (via drill 0.35)
  Top 0.152: IC7.4 33.25,15.9 C31.2 33.54,15.69 v36.35,15.69 | COMM_MICRO.50 52.8,45.62 51.25,44.06 49.12,44.06 47.66,42.6 47.66,38.24 46.82,37.4 46.68,37.4 44.85,35.56 v44.85,34.38 | v42.38,30.48 42.38,25.58 v42.44,25.52
  Bottom 0.152: v44.85,34.38 44.85,32.95 v42.38,30.48 | v36.35,15.69 42.44,21.77 v42.44,25.52
RESET_NEOM8  (via drill 0.35)
  Top 0.152: COMM_MICRO.43 55.98,42.07 v56.88,41.18 | v58,38.25 58.79,37.46 v58.79,30.88 | v60.19,28.75 61.46,27.48 61.93,27.48 63.33,26.08 v63.38,26.08 | v68.06,12.38 68.08,12.36 U$3.8
  Bottom 0.152: v56.88,41.18 58,40.05 v58,38.25 | v60.19,28.75 58.79,30.15 v58.79,30.88 | v63.38,26.08 68.06,21.4 v68.06,12.38
RESET_TESEO  (via drill 0.35)
  Top 0.152: COMM_MICRO.62 46.8,45.63 47.36,45.08 47.36,44.56 47.05,44.26 47.05,38.49 46.57,38.01 46.31,38.01 43,34.7 v43,34.38 | v40.56,30.48 40.56,25.98 40.08,25.5 v40.06,25.5 | v32.33,22.83 31,21.5 IC7.9
  Bottom 0.152: v43,34.38 43,32.92 v40.56,30.48 | 32.39,22.83 v32.33,22.83 35,25.5 v40.06,25.5
S0  (via drill 0.35)
  Top 0.152: COMM_MICRO.33 55.16,32 55.33,31.83 v55.33,30.86 | v24.89,32.02 24.89,34.86 23.34,36.41 IC1.11
  Bottom 0.152: v55.33,30.86 52.97,28.5 28.41,28.5 v24.89,32.02
S1  (via drill 0.35)
  Top 0.152: COMM_MICRO.24 49.3,34.35 48.12,33.17 48.12,31.72 48.65,31.2 48.65,30.21 47.81,29.38 v47.81,29.29 | v25.54,32.65 25.54,35.46 23.32,37.67 IC1.10
  Bottom 0.152: v47.81,29.29 47.64,29.12 29.07,29.12 v25.54,32.65
S2  (via drill 0.35)
  Top 0.152: COMM_MICRO.21 47.8,33.8 v47.81,33.79 | v25.62,36.88 23.55,38.95 IC1.9
  Bottom 0.152: v47.81,33.79 47.81,33.67 44.02,29.88 32.62,29.88 v25.62,36.88
SCL1  (via drill 0.35)
  Top 0.152: COMM_MICRO.61 47.3,51.82 46.22,52.91 45.06,52.91 44.62,53.34 44.62,69.38 v44.25,69.75
  Bottom 0.152: JP2.24 45.38,77.03 45.38,72.74 R20.1 44.19,69.81 v44.25,69.75
SCL2  (via drill 0.35)
  Top 0.152: COMM_MICRO.23 48.8,38.19 50.5,39.88 50.5,41.75 54,45.25 54,67.12 v51.88,69.25
  Bottom 0.152: JP2.26 50.5,77.12 50.5,72.86 R19.1 51.88,71.49 v51.88,69.25
SCL3  (via drill 0.35)
  Top 0.152: JP2.19 41.63,75.41 40.5,74.28 40.5,72.47 41.42,71.55 R11.1 | COMM_MICRO.8 44.73,41.07 46.14,42.48 46.14,43.86 44,46 v44,48.22
  Bottom 0.152: v44,48.22 43.97,48.22 41.63,50.56 JP2.19
SCL4  (via drill 0.35)
  Top 0.152: 51.75,34.5 51.8,34.55 COMM_MICRO.29 51.8,34.14 51.72,34.06 v51.72,33.81 | v51.66,29.25 51.77,29.14 v51.77,25.64 | 64,21.88 64,22.57 U$3.19 63.98,21.89 63.38,21.3 53.99,21.3 v51.85,23.44 50.42,22.02 48.84,22.02 48.26,21.43 48.26,20 47.15,18.89 R24.1 | IC7.17 25.3,13.7 28,11 43.86,11 v51.85,18.99 53.34,20.48 72.72,20.48 75.45,23.21 VARELLA_AQUISITION_MODULE.5
  Bottom 0.152: v51.72,33.81 51.72,29.32 v51.66,29.25 | v51.85,18.99 v51.85,23.44 51.77,23.52 v51.77,25.64
SCLK_BUS  (via drill 0.35)
  Top 0.152: v46.12,38.92 44.78,37.57 COMM_MICRO.15
  Bottom 0.152: JP2.15 36.45,75.83 34.5,73.88 34.5,55.13 47.31,42.33 50.12,42.33 50.73,42.94 52.44,42.94 53.19,42.19 53.19,40.75 50.43,37.99 47.99,37.99 47.06,38.92 v46.12,38.92
SCLK_SENSOR  (via drill 0.35)
  Top 0.152: U3.10 17.66,27.84 v15.75,29.75 | U2.10 17.66,42.34 v15.75,44.25 | v15.75,58.38 17.29,56.84 U1.10 20.29,56.84 21.84,55.28 IC6.6 23.84,55.28 v25.12,54 | IC5.6 v25.12,51.03 | IC4.6 v25.12,46.78 | IC3.6 v25.12,42.53 | COMM_MICRO.34 51.43,37.57 50.34,38.66 v50.19,38.66 | VARELLA_AQUISITION_MODULE.2 v75.42,19.46 v75.41,19.45
  Bottom 0.152: v25.12,54 v25.12,51.03 v25.12,46.78 v25.12,42.53 | v50.19,38.66 49.88,38.66 47.91,40.62 45.88,40.62 26,60.5 17.8,60.5 15.75,58.45 v15.75,58.38 v15.75,44.25 v15.75,29.75 15.75,29.67 18.67,26.75 68.1,26.75 v75.41,19.45
SDA1
  Top 0.152: 44.34,71.7 R21.2 46.6,71.55 I2C1.2 46.75,58.88 48.3,57.32 COMM_MICRO.59
SDA1/UART_RX
  Top 0.152: 46.71,75.51 JP2.23 46.75,75.79 UART_TX.1 46.71,73.34
  Bottom 0.152: JP2.23 46.71,73.34 UART_TX.1
SDA2
  Top 0.152: COMM_MICRO.56 49.8,50.25 50.88,51.32 50.88,67.62 49.25,69.25 I2C2.2 51.66,71.7 R22.2
SDA2/UART_TX
  Top 0.152: JP2.25 UART_RX.1
  Bottom 0.152: JP2.25 UART_RX.1
SDA3  (via drill 0.35)
  Top 0.152: JP2.17 39.09,75.81 38,74.72 38,72.54 38.44,72.1 38.54,72.1 R18.1 | COMM_MICRO.9 44.82,40.57 46.45,42.2 46.45,44.01 44.62,45.83 44.62,46.47 v44.66,46.5
  Bottom 0.152: JP2.17 39.09,52.07 v44.66,46.5
SDA4  (via drill 0.35)
  Top 0.152: COMM_MICRO.30 52.3,36.33 52.81,36.84 54.04,36.84 54.8,36.08 54.8,34.06 v54.55,33.81 | v53.09,25.64 54.62,27.18 v54.62,28.75 | 65.08,21.82 U$3.18 | IC7.16 25.76,14.8 29.16,11.4 43.19,11.4 49.69,17.9 R25.1 50.01,18.89 51.28,20.16 51.95,20.16 v53.06,21.27 53.42,20.91 64.15,20.91 65.08,21.84 U$3.18 | VARELLA_AQUISITION_MODULE.6 77.03,24.41 76.83,24.21 66.68,24.21 U$3.18
  Bottom 0.152: v54.55,33.81 54.55,32.62 55.95,31.21 55.95,30.07 v54.62,28.75 | 53.01,21.32 v53.06,21.27 53.09,21.3 v53.09,25.64
SDMMC_CK  (via drill 0.35)
  Top 0.152: v52.47,50.28 51.3,49.12 COMM_MICRO.53
  Bottom 0.152: MICROSD_CARD.5 61.78,58.6 53.47,50.28 v52.47,50.28
SDMMC_CMD  (via drill 0.35)
  Top 0.152: v52.45,51.43 50.8,49.79 COMM_MICRO.54
  Bottom 0.152: MICROSD_CARD.3 61.82,60.8 v52.45,51.43
SDMMC_D0  (via drill 0.35)
  Top 0.152: COMM_MICRO.39 59.9,40.07 62.25,42.42 62.25,53.88 v64.75,56.38
  Bottom 0.152: MICROSD_CARD.7 64.78,56.4 v64.75,56.38
SDMMC_D1  (via drill 0.35)
  Top 0.152: COMM_MICRO.40 59.7,40.57 61.75,42.62 61.75,54.41 v62.61,55.27
  Bottom 0.152: MICROSD_CARD.8 62.64,55.3 v62.61,55.27
SDMMC_D2  (via drill 0.35)
  Top 0.152: v52.5,48 52.5,47.5 52.3,47.3 COMM_MICRO.51
  Bottom 0.152: MICROSD_CARD.1 62.5,63 51.38,51.88 51.38,49.38 52.5,48.25 v52.5,48
SDMMC_D3  (via drill 0.35)
  Top 0.152: v52.48,49.14 52.48,48.89 51.8,48.22 COMM_MICRO.52
  Bottom 0.152: MICROSD_CARD.2 61.9,61.9 51.75,51.75 51.75,50.12 52.48,49.39 v52.48,49.14
SWCLK  (via drill 0.35)
  Top 0.152: COMM_MICRO.49 53.3,66.82 51.25,68.88 51.25,69.5 51.75,70 65.12,70 v66.7,68.42 | CODE_UPLOAD.5 75.61,59.52 75,60.13 v74.99,60.13
  Bottom 0.152: v74.99,60.13 v66.7,68.42
SWDIO  (via drill 0.35)
  Top 0.152: COMM_MICRO.46 55.95,43.57 56.25,43.88 56.25,46.38 57.5,47.62 59.88,47.62 60.03,47.48 60.03,47.47 60.25,47.25 60.25,45.62 59.75,45.12 57.5,45.12 57.25,44.88 57.25,44.25 57.62,43.88 59.88,43.88 61.25,45.25 61.25,62.25 v64.38,65.38 | v73,61.07 73.29,60.77 CODE_UPLOAD.6
  Bottom 0.152: v64.38,65.38 68.69,65.38 v73,61.07
SWO  (via drill 0.35)
  Top 0.152: CODE_UPLOAD.10 76.72,65.78 v74.72,67.78 | v67,70.47 51.54,70.47 50.78,69.72 50.78,68.66 51.38,68.07 51.38,51.07 50.3,50 COMM_MICRO.55
  Bottom 0.152: v67,70.47 72.03,70.47 v74.72,67.78
T1+
  Top 0.152: 13.46,57.49 U1.4 | 11.06,58.49 R3.2 11.19,58.39 12.04,57.54 | C3.1 13.14,51.44 13.04,51.54 | 15.87,61.55 C2.2 | 12.04,57.54 12.09,57.49 | 12.04,57.54 12.04,57.45
  Top 0.203: 15.87,61.55 15.87,59.87 13.49,57.49 U1.4 12.09,57.49 11.19,58.39 | 12.04,57.45 12.04,52.54 13.04,51.54
T1-
  Top 0.152: 13.57,61.3 R1.2 13.24,61.61 13.87,60.98 13.87,59.65 | 18.45,61.63 C1.2
  Top 0.203: U1.3 13.46,58.14 13.87,58.55 13.87,59.65 13.87,60.88 13.24,61.51 R1.2 13.58,61.63 15.48,63.53 C2.1 16.55,63.53 18.45,61.63
T2+
  Top 0.152: 13.46,42.99 U2.4 | 11.06,43.99 R5.2 11.19,43.89 12.04,43.04 | C8.1 13.14,36.94 13.04,37.04 | 15.87,47.05 C7.2 | 12.04,43.04 12.09,42.99 | 12.04,43.04 12.04,42.95
  Top 0.203: 15.87,47.05 15.87,45.37 13.49,42.99 U2.4 12.09,42.99 11.19,43.89 | 12.04,42.95 12.04,38.04 13.04,37.04
T2-
  Top 0.152: 13.57,46.8 R4.2 13.24,45.86 13.87,45.23 13.87,45.15 | 18.45,47.13 C6.2
  Top 0.203: U2.3 13.46,43.64 13.87,44.05 13.87,45.15 13.87,45.25 13.24,45.88 R4.2 13.62,47.13 15.52,49.03 C7.1 16.55,49.03 18.45,47.13
T3+
  Top 0.152: 13.46,28.49 U3.4 | 11.06,29.49 R7.2 11.19,29.39 12.04,28.54 | C13.1 13.14,22.44 13.04,22.54 | 15.87,32.55 C12.2 | 12.04,28.54 12.09,28.49 | 12.04,28.54 12.04,28.45
  Top 0.203: 15.87,32.55 15.87,30.87 13.49,28.49 U3.4 12.09,28.49 11.19,29.39 | 12.04,28.45 12.04,23.54 13.04,22.54
T3-
  Top 0.152: 13.57,32.3 R6.2 13.24,31.36 13.87,30.73 13.87,30.65 | 18.45,32.63 C11.2
  Top 0.203: U3.3 13.46,29.14 13.87,29.55 13.87,30.65 13.87,30.75 13.24,31.38 R6.2 13.62,32.63 15.52,34.53 C12.1 16.55,34.53 18.45,32.63
TESEO3  (via drill 0.35)
  Top 0.254: U$2.P$1 19.65,70.95 v19.6,70.9 | v36.36,21.77 36.42,21.77 37,21.19
  Top 0.305: L4-27NH.1 36.02,20.21 37,21.19 C30.1 | C43.1 40,17.14 40,19.69 38.59,21.09 | R30.2 29.04,71.6 23.65,71.6 U$2.P$1
  Top 0.406: 38.59,21.09 C30.1
  Top 0.508: R30.2
  Bottom 0.254: v19.6,70.9 8.8,60.1 8.8,29.4 15.4,22.8 15.4,22.7 16.07,22.03 35.99,22.03 36.31,21.71 v36.36,21.77
THERM1+
  Top 0.152: 10.88,56.41 10.92,56.45
  Top 0.203: X1.1 10.7,56.23 10.88,56.41
  Top 0.305: 10.92,56.45 R3.1
THERM1-
  Top 0.2: R1.1 12.82,63.53 8.84,59.55
  Top 0.203: U1.2 12.41,58.79 11.65,59.55 8.84,59.55 8.06,58.77 X1.2
THERM2+
  Top 0.152: 10.88,41.91 10.92,41.95
  Top 0.203: X2.1 10.7,41.73 10.88,41.91
  Top 0.305: 10.92,41.95 R5.1
THERM2-
  Top 0.2: R4.1 12.95,49.03 8.97,45.05
  Top 0.203: U2.2 12.41,44.29 11.65,45.05 8.97,45.05 8.19,44.27 X2.2
THERM3+
  Top 0.152: 10.88,27.41 10.92,27.45
  Top 0.203: X3.1 10.7,27.23 10.88,27.41
  Top 0.305: 10.92,27.45 R7.1
THERM3-
  Top 0.2: R6.1 12.95,34.53 8.97,30.55
  Top 0.203: U3.2 12.41,29.79 11.65,30.55 8.97,30.55 8.19,29.77 X3.2
UART_RX  (via drill 0.35)
  Top 0.152: v49.26,43.29 49.2,43.29 47.99,42.08 47.99,38.11 46.94,37.07 46.87,37.07 45.8,36 COMM_MICRO.17 | RX_CODE.1 v72,60.07 | v61.5,67.12 58.56,67.12 v58.19,66.75 | v50,67.5 v48.12,69.38
  Bottom 0.152: v49.26,43.29 v49.25,43.3 49.25,57.81 56.97,65.53 | v72,60.07 67.75,64.31 63.88,64.31 62.56,65.62 62.56,66.06 v61.5,67.12 | v58.19,66.75 56.97,65.53 | 56.97,65.53 56.97,66.41 55.88,67.5 v50,67.5 | v48.12,69.38 46.75,70.75 UART_TX.2
UART_RX_CODE
  Top 0.152: RX_CODE.2 72.95,55.75 75.25,55.75 76.53,57.02 CODE_UPLOAD.3
UART_TX  (via drill 0.35)
  Top 0.152: v46.75,44.81 46.75,38.62 46.44,38.31 46.18,38.31 44.94,37.07 COMM_MICRO.16 | TX_CODE.1 74.5,58.57 v73,60.07 | v63.25,65.94 63.19,66 v56.25,66
  Bottom 0.152: v46.75,44.81 46.75,56.5 v49.25,59 | v73,60.07 68.32,64.75 64,64.75 63.69,65.06 63.69,65.5 v63.25,65.94 | v56.25,66 v49.25,59 | UART_RX.2 v49.25,59
UART_TX_CODE
  Top 0.152: TX_CODE.2 76.08,58.27 CODE_UPLOAD.4
Y0  (via drill 0.35)
  Top 0.152: U1.9 19.31,56.19 v20,55.5 | v21.38,33.88 21.39,33.87 IC1.13
  Bottom 0.152: v20,55.5 20.61,54.89 20.61,34.64 v21.38,33.88
Y1  (via drill 0.35)
  Top 0.152: U2.9 19.31,41.69 v20,41 | v21.38,32.62 21.41,32.59 IC1.14
  Bottom 0.152: v20,41 20,34 v21.38,32.62
Y2  (via drill 0.35)
  Top 0.152: U3.9 19.19,27.19 20.68,28.68 v20.7,28.68 | v21.38,31.31 21.39,31.32 IC1.15
  Bottom 0.152: v20.7,28.68 20.7,30.63 v21.38,31.31
Y3  (via drill 0.35)
  Top 0.152: 23.11,35.13 IC1.12 23.36,35.13 24.25,34.25 v24.25,31.38 | VARELLA_AQUISITION_MODULE.4 75.44,21.96 v75.41,21.99
  Bottom 0.152: v24.25,31.38 27.5,28.12 63.42,28.12 63.79,28.5 68.9,28.5 v75.41,21.99
Y4
  Top 0.152: IC6.1 28.5,54.01 R17.1 31.16,53.87 33.62,51.4 33.62,33.5 30.18,30.05 IC1.1
Y5
  Top 0.152: IC3.1 31.14,41.23 R12.1 31.91,41.26 32.5,40.66 32.5,35.38 31.94,34.81 30.23,34.81 29.91,35.13 IC1.5
Y6
  Top 0.152: IC5.1 28.5,49.76 R16.1 31.91,49.76 33.25,48.41 33.25,33.75 30.82,31.32 IC1.2
Y7
  Top 0.152: IC4.1 28.5,45.51 R15.1 31.91,45.51 32.88,44.54 32.88,33.88 31.75,32.75 30.38,32.75 29.25,33.88 IC1.4

## Text on the board
tPlace: C:/Users/marcu/Desktop/Ensino Superior/Graduação - Eng Elétrica/Zenith/zenith-v2.bmp | C:/Users/marcu/Desktop/zenith-v3.bmp
tNames: Varella Std. - v.2.0 - 2020